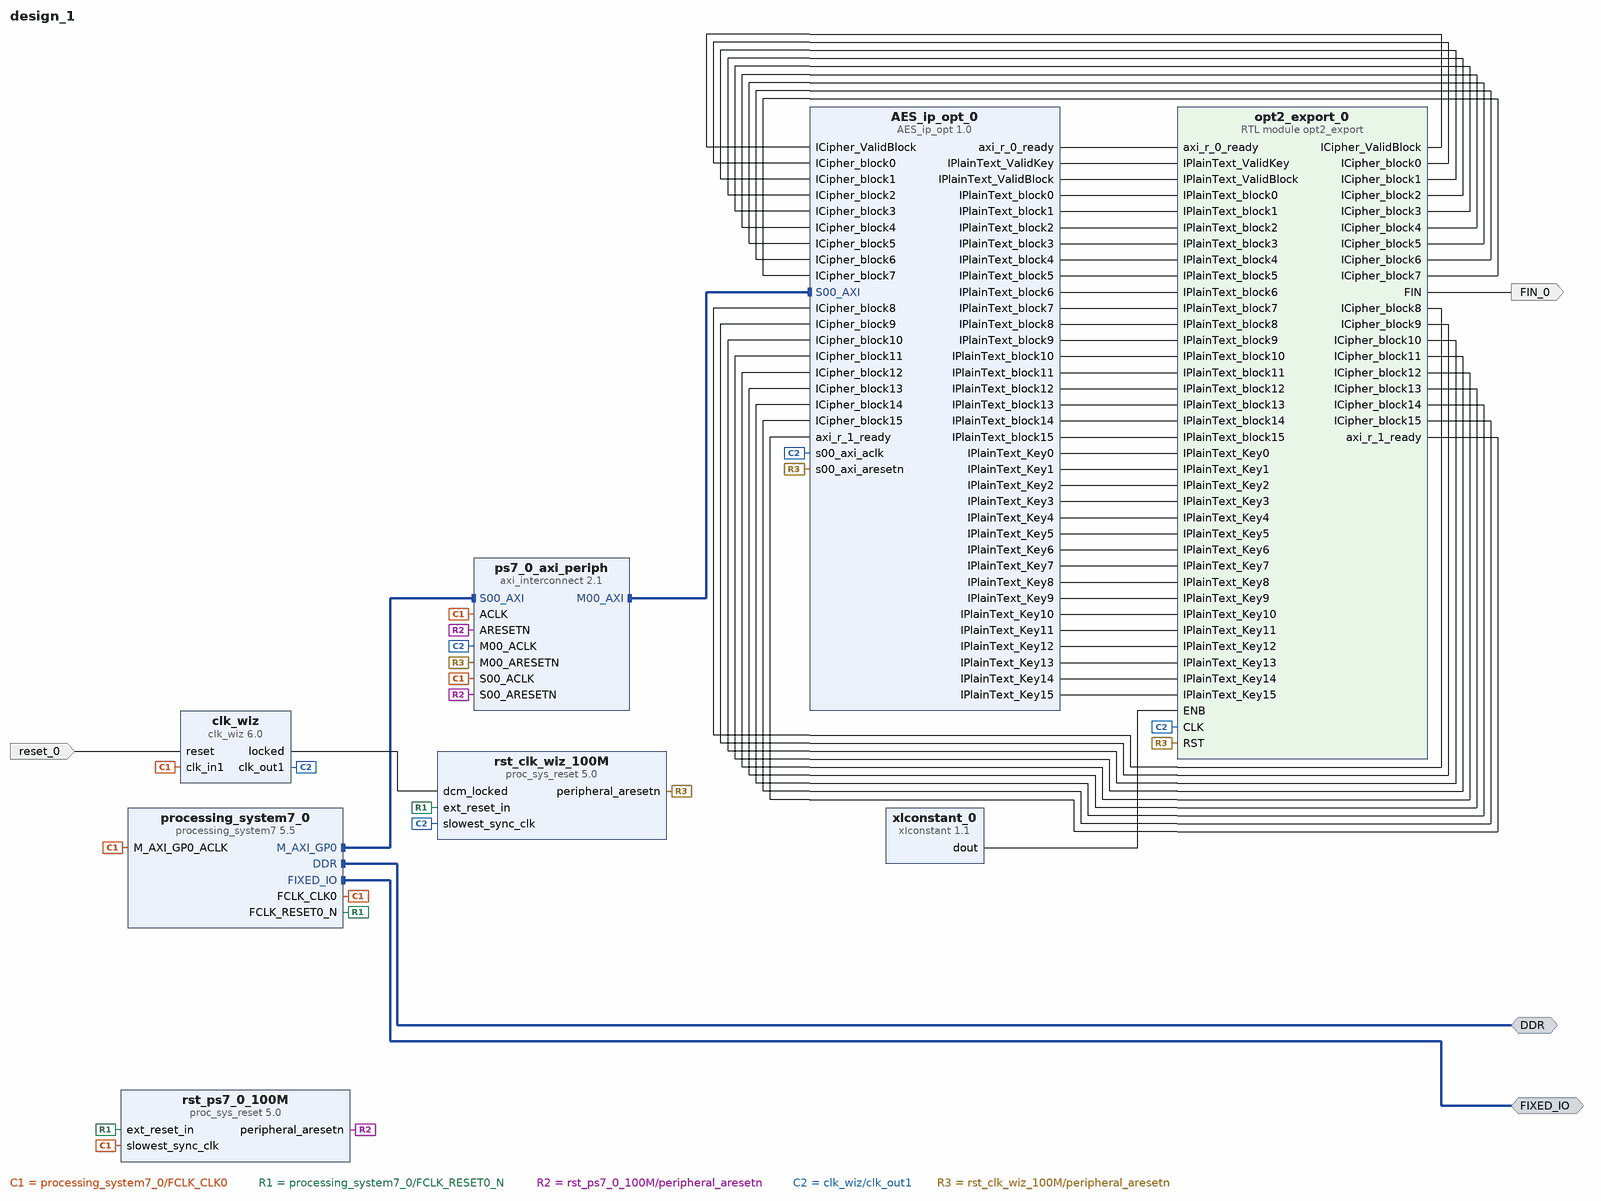
[diagram p0: block diagram of the top level]
# Vivado block design design_1, xc7z020clg484-1, Vivado 2020.2
create_bd_design design_1

create_bd_intf_port -mode Master -vlnv xilinx.com:interface:ddrx_rtl:1.0 DDR
create_bd_intf_port -mode Master -vlnv xilinx.com:display_processing_system7:fixedio_rtl:1.0 FIXED_IO
create_bd_port -dir O FIN_0
create_bd_port -dir I -type rst reset_0
set_property -dict {CONFIG.POLARITY ACTIVE_HIGH} [get_bd_ports reset_0]

create_bd_cell -type ip -vlnv user.org:user:AES_ip_opt:1.0 AES_ip_opt_0
create_bd_cell -type module -reference opt2_export opt2_export_0
create_bd_cell -type ip -vlnv xilinx.com:ip:processing_system7:5.5 processing_system7_0
set_property -dict [list \
  CONFIG.PCW_APU_PERIPHERAL_FREQMHZ 666.666667 \
  CONFIG.PCW_ENET0_ENET0_IO {MIO 16 .. 27} \
  CONFIG.PCW_ENET0_GRP_MDIO_ENABLE 1 \
  CONFIG.PCW_ENET0_GRP_MDIO_IO {MIO 52 .. 53} \
  CONFIG.PCW_ENET0_PERIPHERAL_ENABLE 1 \
  CONFIG.PCW_ENET0_RESET_ENABLE 0 \
  CONFIG.PCW_ENET_RESET_ENABLE 1 \
  CONFIG.PCW_ENET_RESET_SELECT {Share reset pin} \
  CONFIG.PCW_FPGA0_PERIPHERAL_FREQMHZ 100.000000 \
  CONFIG.PCW_FPGA1_PERIPHERAL_FREQMHZ 150.000000 \
  CONFIG.PCW_FPGA2_PERIPHERAL_FREQMHZ 50.000000 \
  CONFIG.PCW_GPIO_MIO_GPIO_ENABLE 1 \
  CONFIG.PCW_GPIO_MIO_GPIO_IO MIO \
  CONFIG.PCW_I2C_RESET_ENABLE 1 \
  CONFIG.PCW_PRESET_BANK1_VOLTAGE {LVCMOS 1.8V} \
  CONFIG.PCW_QSPI_GRP_SINGLE_SS_ENABLE 1 \
  CONFIG.PCW_QSPI_GRP_SINGLE_SS_IO {MIO 1 .. 6} \
  CONFIG.PCW_QSPI_PERIPHERAL_ENABLE 1 \
  CONFIG.PCW_QSPI_PERIPHERAL_FREQMHZ 200.000000 \
  CONFIG.PCW_QSPI_QSPI_IO {MIO 1 .. 6} \
  CONFIG.PCW_SD0_GRP_CD_ENABLE 1 \
  CONFIG.PCW_SD0_GRP_CD_IO {MIO 47} \
  CONFIG.PCW_SD0_GRP_WP_ENABLE 1 \
  CONFIG.PCW_SD0_GRP_WP_IO {MIO 46} \
  CONFIG.PCW_SD0_PERIPHERAL_ENABLE 1 \
  CONFIG.PCW_SD0_SD0_IO {MIO 40 .. 45} \
  CONFIG.PCW_SDIO_PERIPHERAL_FREQMHZ 50 \
  CONFIG.PCW_SINGLE_QSPI_DATA_MODE x4 \
  CONFIG.PCW_TTC0_PERIPHERAL_ENABLE 1 \
  CONFIG.PCW_TTC0_TTC0_IO EMIO \
  CONFIG.PCW_UART1_PERIPHERAL_ENABLE 1 \
  CONFIG.PCW_UART1_UART1_IO {MIO 48 .. 49} \
  CONFIG.PCW_UART_PERIPHERAL_FREQMHZ 50 \
  CONFIG.PCW_UIPARAM_DDR_FREQ_MHZ 533.333313 \
  CONFIG.PCW_UIPARAM_DDR_PARTNO {MT41J128M16 HA-15E} \
  CONFIG.PCW_USB0_PERIPHERAL_ENABLE 1 \
  CONFIG.PCW_USB0_RESET_ENABLE 0 \
  CONFIG.PCW_USB0_USB0_IO {MIO 28 .. 39} \
  CONFIG.PCW_USB_RESET_ENABLE 1 \
  CONFIG.PCW_USB_RESET_SELECT {Share reset pin} \
  CONFIG.preset ZedBoard \
] [get_bd_cells processing_system7_0]
# 221 more settings of processing_system7_0 are not shown: defaults, MIO pin electricals, DDR timing, and values the tool derives
create_bd_cell -type ip -vlnv xilinx.com:ip:axi_interconnect:2.1 ps7_0_axi_periph
set_property -dict {CONFIG.NUM_MI 1} [get_bd_cells ps7_0_axi_periph]
create_bd_cell -type ip -vlnv xilinx.com:ip:clk_wiz:6.0 clk_wiz
set_property -dict [list \
  CONFIG.CLKOUT1_JITTER 210.819 \
  CONFIG.CLKOUT1_PHASE_ERROR 300.278 \
  CONFIG.CLKOUT1_REQUESTED_OUT_FREQ 208.000 \
  CONFIG.MMCM_CLKFBOUT_MULT_F 52.000 \
  CONFIG.MMCM_CLKOUT0_DIVIDE_F 5.000 \
  CONFIG.MMCM_DIVCLK_DIVIDE 5 \
] [get_bd_cells clk_wiz]
create_bd_cell -type ip -vlnv xilinx.com:ip:proc_sys_reset:5.0 rst_ps7_0_100M
create_bd_cell -type ip -vlnv xilinx.com:ip:proc_sys_reset:5.0 rst_clk_wiz_100M
create_bd_cell -type ip -vlnv xilinx.com:ip:xlconstant:1.1 xlconstant_0

# ---- connections ----

connect_bd_intf_net [get_bd_intf_pins ps7_0_axi_periph/M00_AXI] [get_bd_intf_pins AES_ip_opt_0/S00_AXI]
connect_bd_intf_net [get_bd_intf_ports DDR] [get_bd_intf_pins processing_system7_0/DDR]
connect_bd_intf_net [get_bd_intf_pins processing_system7_0/M_AXI_GP0] [get_bd_intf_pins ps7_0_axi_periph/S00_AXI]
connect_bd_intf_net [get_bd_intf_ports FIXED_IO] [get_bd_intf_pins processing_system7_0/FIXED_IO]
connect_bd_net [get_bd_pins AES_ip_opt_0/axi_r_0_ready] [get_bd_pins opt2_export_0/axi_r_0_ready]
connect_bd_net [get_bd_pins opt2_export_0/ICipher_ValidBlock] [get_bd_pins AES_ip_opt_0/ICipher_ValidBlock]
connect_bd_net [get_bd_pins opt2_export_0/ICipher_block0] [get_bd_pins AES_ip_opt_0/ICipher_block0]
connect_bd_net [get_bd_pins opt2_export_0/ICipher_block1] [get_bd_pins AES_ip_opt_0/ICipher_block1]
connect_bd_net [get_bd_pins opt2_export_0/ICipher_block2] [get_bd_pins AES_ip_opt_0/ICipher_block2]
connect_bd_net [get_bd_pins opt2_export_0/ICipher_block3] [get_bd_pins AES_ip_opt_0/ICipher_block3]
connect_bd_net [get_bd_pins opt2_export_0/ICipher_block4] [get_bd_pins AES_ip_opt_0/ICipher_block4]
connect_bd_net [get_bd_pins opt2_export_0/ICipher_block5] [get_bd_pins AES_ip_opt_0/ICipher_block5]
connect_bd_net [get_bd_pins opt2_export_0/ICipher_block6] [get_bd_pins AES_ip_opt_0/ICipher_block6]
connect_bd_net [get_bd_pins opt2_export_0/ICipher_block7] [get_bd_pins AES_ip_opt_0/ICipher_block7]
connect_bd_net [get_bd_pins opt2_export_0/ICipher_block8] [get_bd_pins AES_ip_opt_0/ICipher_block8]
connect_bd_net [get_bd_pins opt2_export_0/ICipher_block9] [get_bd_pins AES_ip_opt_0/ICipher_block9]
connect_bd_net [get_bd_pins opt2_export_0/ICipher_block10] [get_bd_pins AES_ip_opt_0/ICipher_block10]
connect_bd_net [get_bd_pins opt2_export_0/ICipher_block11] [get_bd_pins AES_ip_opt_0/ICipher_block11]
connect_bd_net [get_bd_pins opt2_export_0/ICipher_block12] [get_bd_pins AES_ip_opt_0/ICipher_block12]
connect_bd_net [get_bd_pins opt2_export_0/ICipher_block13] [get_bd_pins AES_ip_opt_0/ICipher_block13]
connect_bd_net [get_bd_pins opt2_export_0/ICipher_block14] [get_bd_pins AES_ip_opt_0/ICipher_block14]
connect_bd_net [get_bd_pins opt2_export_0/ICipher_block15] [get_bd_pins AES_ip_opt_0/ICipher_block15]
connect_bd_net [get_bd_pins AES_ip_opt_0/IPlainText_ValidKey] [get_bd_pins opt2_export_0/IPlainText_ValidKey]
connect_bd_net [get_bd_pins AES_ip_opt_0/IPlainText_ValidBlock] [get_bd_pins opt2_export_0/IPlainText_ValidBlock]
connect_bd_net [get_bd_pins AES_ip_opt_0/IPlainText_block0] [get_bd_pins opt2_export_0/IPlainText_block0]
connect_bd_net [get_bd_pins AES_ip_opt_0/IPlainText_block1] [get_bd_pins opt2_export_0/IPlainText_block1]
connect_bd_net [get_bd_pins AES_ip_opt_0/IPlainText_block2] [get_bd_pins opt2_export_0/IPlainText_block2]
connect_bd_net [get_bd_pins AES_ip_opt_0/IPlainText_block3] [get_bd_pins opt2_export_0/IPlainText_block3]
connect_bd_net [get_bd_pins AES_ip_opt_0/IPlainText_block4] [get_bd_pins opt2_export_0/IPlainText_block4]
connect_bd_net [get_bd_pins AES_ip_opt_0/IPlainText_block5] [get_bd_pins opt2_export_0/IPlainText_block5]
connect_bd_net [get_bd_pins AES_ip_opt_0/IPlainText_block6] [get_bd_pins opt2_export_0/IPlainText_block6]
connect_bd_net [get_bd_pins AES_ip_opt_0/IPlainText_block7] [get_bd_pins opt2_export_0/IPlainText_block7]
connect_bd_net [get_bd_pins AES_ip_opt_0/IPlainText_block8] [get_bd_pins opt2_export_0/IPlainText_block8]
connect_bd_net [get_bd_pins AES_ip_opt_0/IPlainText_block9] [get_bd_pins opt2_export_0/IPlainText_block9]
connect_bd_net [get_bd_pins AES_ip_opt_0/IPlainText_block10] [get_bd_pins opt2_export_0/IPlainText_block10]
connect_bd_net [get_bd_pins AES_ip_opt_0/IPlainText_block11] [get_bd_pins opt2_export_0/IPlainText_block11]
connect_bd_net [get_bd_pins AES_ip_opt_0/IPlainText_block12] [get_bd_pins opt2_export_0/IPlainText_block12]
connect_bd_net [get_bd_pins AES_ip_opt_0/IPlainText_block13] [get_bd_pins opt2_export_0/IPlainText_block13]
connect_bd_net [get_bd_pins AES_ip_opt_0/IPlainText_block14] [get_bd_pins opt2_export_0/IPlainText_block14]
connect_bd_net [get_bd_pins AES_ip_opt_0/IPlainText_block15] [get_bd_pins opt2_export_0/IPlainText_block15]
connect_bd_net [get_bd_pins AES_ip_opt_0/IPlainText_Key0] [get_bd_pins opt2_export_0/IPlainText_Key0]
connect_bd_net [get_bd_pins AES_ip_opt_0/IPlainText_Key1] [get_bd_pins opt2_export_0/IPlainText_Key1]
connect_bd_net [get_bd_pins AES_ip_opt_0/IPlainText_Key2] [get_bd_pins opt2_export_0/IPlainText_Key2]
connect_bd_net [get_bd_pins AES_ip_opt_0/IPlainText_Key3] [get_bd_pins opt2_export_0/IPlainText_Key3]
connect_bd_net [get_bd_pins AES_ip_opt_0/IPlainText_Key4] [get_bd_pins opt2_export_0/IPlainText_Key4]
connect_bd_net [get_bd_pins AES_ip_opt_0/IPlainText_Key5] [get_bd_pins opt2_export_0/IPlainText_Key5]
connect_bd_net [get_bd_pins AES_ip_opt_0/IPlainText_Key6] [get_bd_pins opt2_export_0/IPlainText_Key6]
connect_bd_net [get_bd_pins AES_ip_opt_0/IPlainText_Key7] [get_bd_pins opt2_export_0/IPlainText_Key7]
connect_bd_net [get_bd_pins AES_ip_opt_0/IPlainText_Key8] [get_bd_pins opt2_export_0/IPlainText_Key8]
connect_bd_net [get_bd_pins AES_ip_opt_0/IPlainText_Key9] [get_bd_pins opt2_export_0/IPlainText_Key9]
connect_bd_net [get_bd_pins AES_ip_opt_0/IPlainText_Key10] [get_bd_pins opt2_export_0/IPlainText_Key10]
connect_bd_net [get_bd_pins AES_ip_opt_0/IPlainText_Key11] [get_bd_pins opt2_export_0/IPlainText_Key11]
connect_bd_net [get_bd_pins AES_ip_opt_0/IPlainText_Key12] [get_bd_pins opt2_export_0/IPlainText_Key12]
connect_bd_net [get_bd_pins AES_ip_opt_0/IPlainText_Key13] [get_bd_pins opt2_export_0/IPlainText_Key13]
connect_bd_net [get_bd_pins AES_ip_opt_0/IPlainText_Key14] [get_bd_pins opt2_export_0/IPlainText_Key14]
connect_bd_net [get_bd_pins AES_ip_opt_0/IPlainText_Key15] [get_bd_pins opt2_export_0/IPlainText_Key15]
connect_bd_net [get_bd_pins opt2_export_0/axi_r_1_ready] [get_bd_pins AES_ip_opt_0/axi_r_1_ready]
connect_bd_net [get_bd_pins opt2_export_0/FIN] [get_bd_ports FIN_0]
connect_bd_net [get_bd_pins processing_system7_0/FCLK_CLK0] \
  [get_bd_pins processing_system7_0/M_AXI_GP0_ACLK] [get_bd_pins ps7_0_axi_periph/S00_ACLK] \
  [get_bd_pins rst_ps7_0_100M/slowest_sync_clk] [get_bd_pins ps7_0_axi_periph/ACLK] [get_bd_pins clk_wiz/clk_in1]
connect_bd_net [get_bd_pins processing_system7_0/FCLK_RESET0_N] [get_bd_pins rst_ps7_0_100M/ext_reset_in] [get_bd_pins rst_clk_wiz_100M/ext_reset_in]
connect_bd_net [get_bd_pins rst_ps7_0_100M/peripheral_aresetn] [get_bd_pins ps7_0_axi_periph/S00_ARESETN] [get_bd_pins ps7_0_axi_periph/ARESETN]
connect_bd_net [get_bd_pins clk_wiz/clk_out1] \
  [get_bd_pins AES_ip_opt_0/s00_axi_aclk] [get_bd_pins ps7_0_axi_periph/M00_ACLK] \
  [get_bd_pins rst_clk_wiz_100M/slowest_sync_clk] [get_bd_pins opt2_export_0/CLK]
connect_bd_net [get_bd_pins clk_wiz/locked] [get_bd_pins rst_clk_wiz_100M/dcm_locked]
connect_bd_net [get_bd_pins rst_clk_wiz_100M/peripheral_aresetn] \
  [get_bd_pins AES_ip_opt_0/s00_axi_aresetn] [get_bd_pins ps7_0_axi_periph/M00_ARESETN] [get_bd_pins opt2_export_0/RST]
connect_bd_net -net reset_0_1 [get_bd_ports reset_0] [get_bd_pins clk_wiz/reset]
connect_bd_net [get_bd_pins xlconstant_0/dout] [get_bd_pins opt2_export_0/ENB]

# ---- address map ----
assign_bd_address -offset 0x43C00000 -range 64K -target_address_space [get_bd_addr_spaces processing_system7_0/Data] [get_bd_addr_segs AES_ip_opt_0/S00_AXI/S00_AXI_reg]

validate_bd_design
save_bd_design
